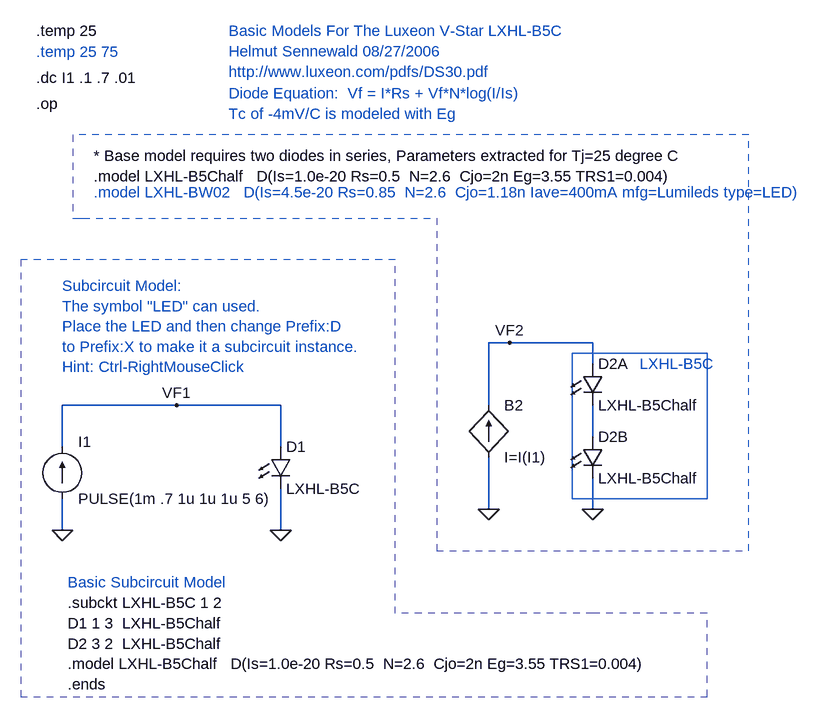
[diagram p0: schematic LXHL-B5C_basic.asc]
LXHL-B5C_basic.asc, the LTspice schematic file:
Version 4
SHEET 1 2272 1848
WIRE 464 160 432 160
WIRE 592 160 464 160
WIRE 592 192 592 160
WIRE -48 256 -224 256
WIRE 112 256 -48 256
WIRE 432 256 432 160
WIRE 592 304 592 256
WIRE -224 320 -224 256
WIRE 112 320 112 256
WIRE 432 416 432 336
WIRE 592 416 592 368
WIRE -224 448 -224 400
WIRE 112 448 112 384
FLAG 592 416 0
FLAG 432 416 0
FLAG 464 160 VF2
FLAG 112 448 0
FLAG -224 448 0
FLAG -48 256 VF1
SYMBOL LED 576 192 R0
SYMATTR InstName D2A
SYMATTR Value LXHL-B5Chalf
SYMATTR Description Diode
SYMATTR Type diode
SYMBOL LED 576 304 R0
SYMATTR InstName D2B
SYMATTR Value LXHL-B5Chalf
SYMATTR Description Diode
SYMATTR Type diode
SYMBOL current -224 400 M180
WINDOW 0 24 88 Left 0
WINDOW 3 24 0 Left 0
WINDOW 123 0 0 Left 0
WINDOW 39 0 0 Left 0
SYMATTR InstName I1
SYMATTR Value PULSE(1m .7 1u 1u 1u 5 6)
SYMBOL LED 96 320 R0
SYMATTR InstName D1
SYMATTR Value LXHL-B5C
SYMATTR Prefix X
SYMATTR Description Diode
SYMATTR Type diode
SYMBOL bi2 432 256 R0
SYMATTR InstName B2
SYMATTR Value I=I(I1)
TEXT -264 -208 Left 0 !.op
TEXT -264 -248 Left 0 !.dc I1 .1 .7 .01
TEXT -176 -72 Left 0 ;.model LXHL-BW02   D(Is=4.5e-20 Rs=0.85  N=2.6  Cjo=1.18n Iave=400mA mfg=Lumileds type=LED)
TEXT -216 560 Left 0 !.subckt LXHL-B5C 1 2\nD1 1 3  LXHL-B5Chalf\nD2 3 2  LXHL-B5Chalf\n.model LXHL-B5Chalf   D(Is=1.0e-20 Rs=0.5  N=2.6  Cjo=2n Eg=3.55 TRS1=0.004)\n.ends
TEXT -264 -288 Left 0 ;.temp 25 75
TEXT -216 528 Left 0 ;Basic Subcircuit Model
TEXT -176 -128 Left 0 !* Base model requires two diodes in series, Parameters extracted for Tj=25 degree C\n.model LXHL-B5Chalf   D(Is=1.0e-20 Rs=0.5  N=2.6  Cjo=2n Eg=3.55 TRS1=0.004)
TEXT 664 192 Left 0 ;LXHL-B5C
TEXT -264 -320 Left 0 !.temp 25
TEXT 32 -320 Left 0 ;Basic Models For The Luxeon V-Star LXHL-B5C\nHelmut Sennewald 08/27/2006\nhttp://www.luxeon.com/pdfs/DS30.pdf
TEXT -224 72 Left 0 ;Subcircuit Model:\nThe symbol "LED" can used.\nPlace the LED and then change Prefix:D \nto Prefix:X to make it a subcircuit instance.\nHint: Ctrl-RightMouseClick
TEXT 32 -224 Left 0 ;Diode Equation:  Vf = I*Rs + Vf*N*log(I/Is)\nTc of -4mV/C is modeled with Eg
LINE Normal 288 32 -288 32 2
LINE Normal 288 576 288 32 2
LINE Normal 592 576 288 576 2
LINE Normal 768 576 592 576 2
LINE Normal 768 704 768 576 2
LINE Normal -288 704 768 704 2
LINE Normal -288 32 -288 704 2
LINE Normal 832 -160 -208 -160 2
LINE Normal 832 480 832 -160 2
LINE Normal 352 480 832 480 2
LINE Normal 352 -32 352 480 2
LINE Normal -192 -32 352 -32 2
LINE Normal -208 -32 -192 -32 2
LINE Normal -208 -160 -208 -32 2
RECTANGLE Normal 768 400 560 176

The netlist it stands for:
* LXHL-B5C_basic.asc
D2A VF2 N001 LXHL-B5Chalf
D2B N001 0 LXHL-B5Chalf
I1 0 VF1 PULSE(1m .7 1u 1u 1u 5 6)
XD1 VF1 0 LXHL-B5C  ; pins + -
B2 0 VF2 I=I(I1)
.model D D
.lib standard.dio
.op
.dc I1 .1 .7 .01
* .model LXHL-BW02   D(Is=4.5e-20 Rs=0.85  N=2.6  Cjo=1.18n Iave=400mA mfg=Lumileds type=LED)
.subckt LXHL-B5C 1 2
D1 1 3  LXHL-B5Chalf
D2 3 2  LXHL-B5Chalf
.model LXHL-B5Chalf   D(Is=1.0e-20 Rs=0.5  N=2.6  Cjo=2n Eg=3.55 TRS1=0.004)
.ends
* .temp 25 75
* Basic Subcircuit Model
* Base model requires two diodes in series, Parameters extracted for Tj=25 degree C
.model LXHL-B5Chalf   D(Is=1.0e-20 Rs=0.5  N=2.6  Cjo=2n Eg=3.55 TRS1=0.004)
* LXHL-B5C
.temp 25
* Basic Models For The Luxeon V-Star LXHL-B5C
* Helmut Sennewald 08/27/2006
* http://www.luxeon.com/pdfs/DS30.pdf
* Subcircuit Model:
* The symbol "LED" can used.
* Place the LED and then change Prefix:D
* to Prefix:X to make it a subcircuit instance.
* Hint: Ctrl-RightMouseClick
* Diode Equation:  Vf = I*Rs + Vf*N*log(I/Is)
* Tc of -4mV/C is modeled with Eg
.backanno
.end